# Altium schematic sheet RF-car.SchDoc
size A3; SPICEModelCacheRLVYLVLF: <root> / <DocumentId>RLVYLVLF</DocumentId> / <CacheFrame Number="0"> / <Model Name="qnpn" Kind="MDL"> / <Text>*QNPN / *NPN Trans Pinout: C,B,E / .MODEL QNPN NPN(IS=3.2E-16 BF=141 VAF=35 ISE=2.6 NE=1.46 CJE=1E-13 / + MJE=0.333 TF=6E-11 CJC=1E-13 CJS=2.2E-13 MJS=0.5 FC=0.67 )</Text> / </Model> / <Model Name="dtunnel1" Kind="CKT"> / <Text>*Tunnel Diode Default / *MCE 600V 50A 27.2ns default parameters / *Diode Pinout: A,K / * Parameters: / * RS:  Series resistance value / * RP:  Negative resistance value in parallel with capacitance. / * CP:   Capacitance value in parallel with negative resistance. / * LS:  Series inductance value. / * / * / .SUBCKT DTUNNEL1 1 2 PARAMS: Rs=6 Rp=-75 Cp=0.6E-12 Ls=0.1nH / RS  1 3  {Rs} / RP  3 4  {Rp} / CP  3 4  {Cp} / LS  4 2  {Ls} / .ENDS DTUNNEL1</Text> / </Model> / <Model Name="pnp" Kind="MDL"> / <Text>*Default PNP BJT / *PNP Trans Pinout: C,B,E / .MODEL PNP PNP()</Text> / </Model> / </CacheFrame> / </root>
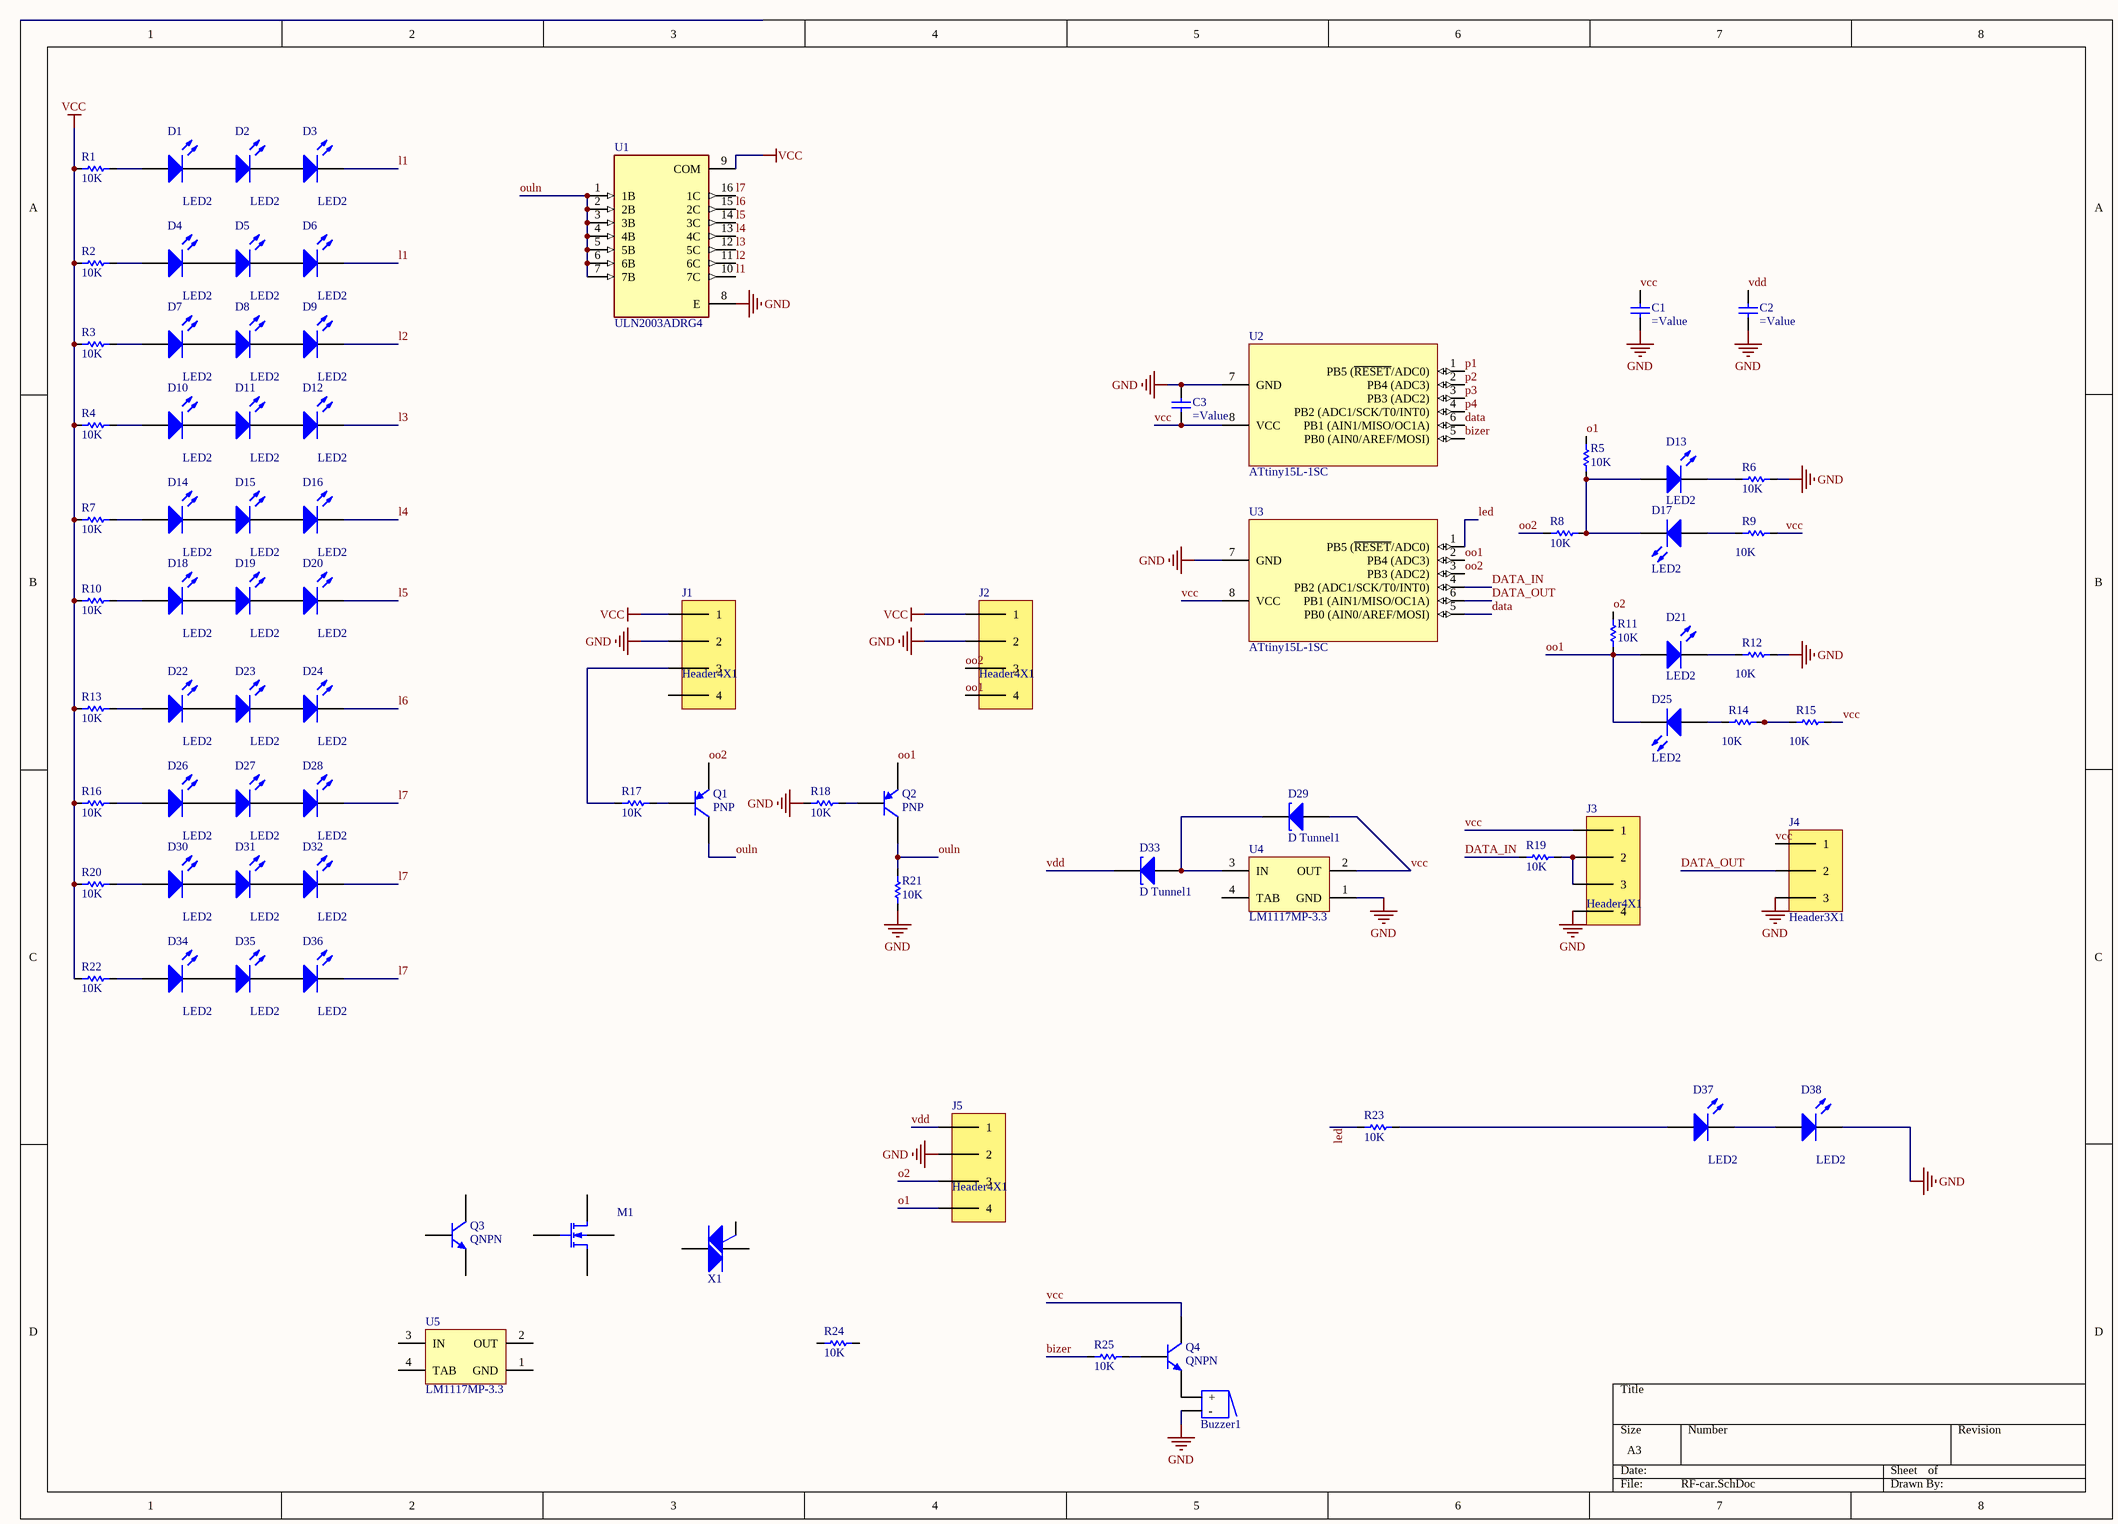
[diagram p0: RF-car.SchDoc]

## Parts
Buzzer1  Buzzer  [BUZZER]  (value not drawn)
C1  (no value)  [CAP 1206]
C2  (no value)  [CAP 1206]
C3  (no value)  [CAP 1206]
D1  LED2  [3.2X1.6X1.1]
D2  LED2  [3.2X1.6X1.1]
D3  LED2  [3.2X1.6X1.1]
D4  LED2  [3.2X1.6X1.1]
D5  LED2  [3.2X1.6X1.1]
D6  LED2  [3.2X1.6X1.1]
D7  LED2  [3.2X1.6X1.1]
D8  LED2  [3.2X1.6X1.1]
D9  LED2  [3.2X1.6X1.1]
D10  LED2  [3.2X1.6X1.1]
D11  LED2  [3.2X1.6X1.1]
D12  LED2  [3.2X1.6X1.1]
D13  LED2  [3.2X1.6X1.1]
D14  LED2  [3.2X1.6X1.1]
D15  LED2  [3.2X1.6X1.1]
D16  LED2  [3.2X1.6X1.1]
D17  LED2  [3.2X1.6X1.1]
D18  LED2  [3.2X1.6X1.1]
D19  LED2  [3.2X1.6X1.1]
D20  LED2  [3.2X1.6X1.1]
D21  LED2  [3.2X1.6X1.1]
D22  LED2  [3.2X1.6X1.1]
D23  LED2  [3.2X1.6X1.1]
D24  LED2  [3.2X1.6X1.1]
D25  LED2  [3.2X1.6X1.1]
D26  LED2  [3.2X1.6X1.1]
D27  LED2  [3.2X1.6X1.1]
D28  LED2  [3.2X1.6X1.1]
D29  D Tunnel1  [3.2X1.6X1.1]
D30  LED2  [3.2X1.6X1.1]
D31  LED2  [3.2X1.6X1.1]
D32  LED2  [3.2X1.6X1.1]
D33  D Tunnel1  [3.2X1.6X1.1]
D34  LED2  [3.2X1.6X1.1]
D35  LED2  [3.2X1.6X1.1]
D36  LED2  [3.2X1.6X1.1]
D37  LED2  [3.2X1.6X1.1]
D38  LED2  [3.2X1.6X1.1]
J1  Header4X1  [HEADER 4X1]
J2  Header4X1  [HEADER 4X1]
J3  Header4X1  [HEADER 4X1]
J4  Header3X1  [HEADER 3X1]
J5  Header4X1  [HEADER 4X1]
M1  N-channel MOSFET BSIM4v7 v4.7.0 Model  (value not drawn)
Q1  PNP  [SOT-23B_N]
Q2  PNP  [SOT-23B_N]
Q3  QNPN  [SOT-23B_L]
Q4  QNPN  [SOT-23B_L]
R1  10K  [RES 1206 (3216X08L)]
R2  10K  [RES 1206 (3216X08L)]
R3  10K  [RES 1206 (3216X08L)]
R4  10K  [RES 1206 (3216X08L)]
R5  10K  [RES 1206 (3216X08L)]
R6  10K  [RES 1206 (3216X08L)]
R7  10K  [RES 1206 (3216X08L)]
R8  10K  [RES 1206 (3216X08L)]
R9  10K  [RES 1206 (3216X08L)]
R10  10K  [RES 1206 (3216X08L)]
R11  10K  [RES 1206 (3216X08L)]
R12  10K  [RES 1206 (3216X08L)]
R13  10K  [RES 1206 (3216X08L)]
R14  10K  [RES 1206 (3216X08L)]
R15  10K  [RES 1206 (3216X08L)]
R16  10K  [RES 1206 (3216X08L)]
R17  10K  [RES 1206 (3216X08L)]
R18  10K  [RES 1206 (3216X08L)]
R19  10K  [RES 1206 (3216X08L)]
R20  10K  [RES 1206 (3216X08L)]
R21  10K  [RES 1206 (3216X08L)]
R22  10K  [RES 1206 (3216X08L)]
R23  10K  [RES 1206 (3216X08L)]
R24  10K  [RES 1206 (3216X08L)]
R25  10K  [RES 1206 (3216X08L)]
U1  ULN2003ADRG4  [SOIC127P600X175-16N]
U2  ATtiny15L-1SC  [8S2_N]
U3  ATtiny15L-1SC  [8S2_N]
U4  LM1117MP-3.3  [SOT89L]
U5  LM1117MP-3.3  [SOT89L]
X1  TRIAC Thyristror  (value not drawn)

## Nets
GND: Buzzer1.2(-) C1.1(+) C2.1(+) C3.2(-) D38.2(K) J1.2 J2.2 J3.4 J4.3 J5.2 R6.2 R12.2 R18.1 R21.1 U1.8(E) U2.7(GND) U3.7(GND) U4.1(GND)
vcc: C1.2(-) C3.1(+) D29.1(A) J1.1 J2.1 J3.1 J4.1 Q4.1(C) R1.1 R2.1 R3.1 R4.1 R7.1 R9.2 R10.1 R13.1 R15.2 R16.1 R20.1 R22.1 U1.9(COM) U2.8(VCC) U3.8(VCC) U4.2(OUT)
bizer: R25.1 U2.5(PB0_(AIN0/AREF/MOSI))
data: U2.6(PB1_(AIN1/MISO/OC1A)) U3.5(PB0_(AIN0/AREF/MOSI))
DATA_IN: R19.1 U3.4(PB2_(ADC1/SCK/T0/INT0))
DATA_OUT: J4.2 U3.6(PB1_(AIN1/MISO/OC1A))
l1: D3.2(K) D6.2(K) U1.10(7C)
l2: D9.2(K) U1.11(6C)
l3: D12.2(K) U1.12(5C)
l4: D16.2(K) U1.13(4C)
l5: D20.2(K) U1.14(3C)
l6: D24.2(K) U1.15(2C)
l7: D28.2(K) D32.2(K) D36.2(K) U1.16(1C)
led: R23.1 U3.1(PB5_(~{RESET}/ADC0))
o1: J5.4 R5.2
o2: J5.3 R11.2
oo1: D21.1(A) D25.2(K) J2.4 Q2.3(E) R11.1 U3.2(PB4_(ADC3))
oo2: J2.3 Q1.3(E) R8.2 U3.3(PB3_(ADC2))
ouln: Q1.1(C) Q2.1(C) R21.2 U1.1(1B) U1.2(2B) U1.3(3B) U1.4(4B) U1.5(5B) U1.6(6B) U1.7(7B)
p1: U2.1(PB5_(~{RESET}/ADC0))
p2: U2.2(PB4_(ADC3))
p3: U2.3(PB3_(ADC2))
p4: U2.4(PB2_(ADC1/SCK/T0/INT0))
vdd: C2.2(-) D33.2(K) J5.1
NetBuzzer1_1: Buzzer1.1(+) Q4.3(E)
NetD1_1: D1.1(A) R1.2
NetD1_2: D1.2(K) D2.1(A)
NetD2_2: D2.2(K) D3.1(A)
NetD4_1: D4.1(A) R2.2
NetD4_2: D4.2(K) D5.1(A)
NetD5_2: D5.2(K) D6.1(A)
NetD7_1: D7.1(A) R3.2
NetD7_2: D7.2(K) D8.1(A)
NetD8_2: D8.2(K) D9.1(A)
NetD10_1: D10.1(A) R4.2
NetD10_2: D10.2(K) D11.1(A)
NetD11_2: D11.2(K) D12.1(A)
NetD13_1: D13.1(A) D17.2(K) R5.1 R8.1
NetD13_2: D13.2(K) R6.1
NetD14_1: D14.1(A) R7.2
NetD14_2: D14.2(K) D15.1(A)
NetD15_2: D15.2(K) D16.1(A)
NetD17_1: D17.1(A) R9.1
NetD18_1: D18.1(A) R10.2
NetD18_2: D18.2(K) D19.1(A)
NetD19_2: D19.2(K) D20.1(A)
NetD21_2: D21.2(K) R12.1
NetD22_1: D22.1(A) R13.2
NetD22_2: D22.2(K) D23.1(A)
NetD23_2: D23.2(K) D24.1(A)
NetD25_1: D25.1(A) R14.1
NetD26_1: D26.1(A) R16.2
NetD26_2: D26.2(K) D27.1(A)
NetD27_2: D27.2(K) D28.1(A)
NetD29_2: D29.2(K) D33.1(A) U4.3(IN)
NetD30_1: D30.1(A) R20.2
NetD30_2: D30.2(K) D31.1(A)
NetD31_2: D31.2(K) D32.1(A)
NetD34_1: D34.1(A) R22.2
NetD34_2: D34.2(K) D35.1(A)
NetD35_2: D35.2(K) D36.1(A)
NetD37_1: D37.1(A) R23.2
NetD37_2: D37.2(K) D38.1(A)
NetJ1_3: J1.3 R17.1
NetJ3_2: J3.2 J3.3 R19.2
NetQ1_2: Q1.2(B) R17.2
NetQ2_2: Q2.2(B) R18.2
NetQ4_2: Q4.2(B) R25.2
NetR14_2: R14.2 R15.1

Not connected (* = marked no-connect by the designer): J1 4; M1 1(D) 2(G) 3(S) 4(B); Q3 1(C) 2(B) 3(E); R24 1 2; U4 4(TAB); U5 1(GND) 2(OUT) 3(IN) 4(TAB); X1 1(A) 2(K) 3

## Library data of the parts
Buzzer1 = Buzzer: Designer: Seyed Mohsen Ghasemain; ComponentLinkURL: www.picpars.com
C1-C3 = Capacitor
D1-D28 D30-D32 D34-D38 = LED2: Typical RED, GREEN, YELLOW, AMBER GaAs LED; Published: 8-Jun-2000; LatestRevisionDate: 17-Jul-2002; LatestRevisionNote: Re-released for DXP Platform.; PackageVersion: Feb-2002; PackageReference: 3.2X1.6X1.1; Publisher: Altium Limited; PackageDescription: SM LED; 2 Flat Leads
D29 D33 = D Tunnel1: Tunnel Diode - RLC Model; Published: 8-Jun-2000; LatestRevisionDate: 17-Jul-2002; LatestRevisionNote: Re-released for DXP Platform.; PackageVersion: Feb-2002; PackageReference: 3.2X1.6X1.1; Publisher: Altium Limited; PackageDescription: SM LED; 2 Flat Leads
M1 = MOSFET N-ch Lev14_3: A0: 1; A1: 0; AIGBACC: 0.0136; AIGBINV: 0.0111; AT: 33000; BG0SUB: 1.16; BGIDL: 2.3e09; BIGBACC: 0.00171; BIGBINV: 0.000949; BVD: 10; CAPMOD: 2; CDSC: 0.00024; CF: 1.07725e-10; CGDO: 1.03594e-09; CGIDL: 0.5; CIGBACC: 0.075; CIGBINV: 0.006; CJD: 0.0005; CJSWD: 5e-10; CKAPPAD: 0.6; CLC: 1e-07; DELTA: 0.01; DROUT: 0.56; DVT0: 2.2; DVT1: 0.53; DVT1W: 5.3e06; DVT2: -0.032; EASUB: 4.05; EGIDL: 0.8; EIGBINV: 1.1; EM: 4.1e07; EOT: 1.5e-09; EPSRGATE: 11.7; EPSROX: 3.9; ETA0: 0.08; ETAB: -0.07; EU: 1.67; GBMIN: 1e-12; IJTHDFWD: 0.1; JSD: 0.0001; K3: 80; KETA: -0.047; KT1: -0.11; KT2: 0.022; LC: 5e-09; LETAB: -0; LP: 1e-08; LPE0: 1.74e-07; MJSWD: 0.33; MOIN: 15; NDEP: 1.7e17; NI0SUB: 1.45e10; NIGBINV: 3; NJTS: 20; NOIA: 6.25e41; NOIB: 3.125e26; NOIC: 8.75e09; NSD: 1e20; NSUB: 6e16; PCLM: 1.3; PDIBLC1: 0.39; PDIBLC2: 0.0086; PSCBE1: 4.24e08; PSCBE2: 1e-05; RBDBX0: 100; RBPD0: 50; RDSW: 200; RNOIA: 0.577; RNOIB: 0.5164; RNOIC: 0.395; SAREF: 1e-06; TBGASUB: 0.000702; TBGBSUB: 1108; TEMPEOT: 300.15; TNOIA: 1.5; TNOIB: 3.5; TOXE: 3e-09; U0: 0.067; UA: 1e-09; UB: 1e-19; UB1: -1e-18; UC: -4.65e-11; UC1: -5.6e-11; UCSTE: -0.004775; UTE: -1.5; VBD_MAX: 1e99; VBM: -3; VFB: -1; VOFF: -0.08; VSAT: 80000; VTH0: 0.7; VTL: 200000; W0: 2.5e-06; XJ: 1.5e-07; XRCRG1: 12; XT: 1.55e-07; XTSD: 0.02; SimulationGenericComponent: True; A2: 1; ACDE: 1; ADOS: 1; AF: 1; AGIDL: 0; AGISL: 0; AGS: 0; AIGC: 0.0136; AIGD: 0.0136; AIGS: 0.0136; AIGSD: 0.0136; ALPHA0: 0; ALPHA1: 0; B0: 0; B1: 0; BDOS: 1; BETA0: 0; BGISL: 2.3e09; BIGC: 0.00171; BIGD: 0.00171; BIGS: 0.00171; BIGSD: 0.00171; BINUNIT: 1; BVS: 10; CDSCB: 0; CDSCD: 0; CGBO: 0; CGDL: 0; CGISL: 0.5; CGSL: 0; CGSO: 1.03594e-09; CIGC: 0.075; CIGD: 0.075; CIGS: 0.075; CIGSD: 0.075; CIT: 0; CJS: 0.0005; CJSWGD: 5e-10; CJSWGS: 5e-10; CJSWS: 5e-10; CKAPPAS: 0.6; CLE: 0.6; CVCHARGEMOD: 0; DIOMOD: 1; DLC: 0; DLCIG: 0; DLCIGD: 0; DMCG: 0; DMCGT: 0; DMCI: 0; DMDG: 0; DSUB: 0.56; DTOX: 0; DVT0W: 0; DVT2W: -0.032; DVTP0: 0; DVTP1: 0; DVTP2: 0; DVTP3: 0; DVTP4: 0; DVTP5: 0; DWB: 0; DWC: 0; DWG: 0; DWJ: 0; EF: 1; EGISL: 0.8; EPSRSUB: 11.7; FGIDL: 1; FGISL: 1; FNOIMOD: 1; FPROUT: 0; GAMMA1: 0; GAMMA2: 0; GIDLMOD: 0; IGBMOD: 0; IGCMOD: 0; IJTHDREV: 0.1; IJTHSFWD: 0.1; IJTHSREV: 0.1; JSS: 0.0001; JSWD: 0; JSWGD: 0; JSWGS: 0; JSWS: 0; JTSD: 0; JTSS: 0; JTSSWD: 0; JTSSWGD: 0; JTSSWGS: 0; JTSSWS: 0; JTWEFF: 0; K1: 0; K2: 0; K2WE: 0; K3B: 0; KF: 0; KGIDL: 0; KGISL: 0; KT1L: 0; KU0: 0; KU0WE: 0; KVSAT: 0; KVTH0: 0; KVTH0WE: 0; LA0: 0; LA1: 0; LA2: 0; LACDE: 0; LAGIDL: 0; LAGISL: 0; LAGS: 0; LAIGBACC: 0; LAIGBINV: 0; LAIGC: 0; LAIGD: 0; LAIGS: 0; LAIGSD: 0; LALPHA0: 0; LALPHA1: 0; LAMBDA: 0; LAT: 0; LB0: 0; LB1: 0; LBETA0: 0; LBGIDL: 0; LBGISL: 0; LBIGBACC: 0; LBIGBINV: 0; LBIGC: 0; LBIGD: 0; LBIGS: 0; LBIGSD: 0; LCDSC: 0; LCDSCB: 0; LCDSCD: 0; LCF: 0; LCGDL: 0; LCGIDL: 0; LCGISL: 0; LCGSL: 0; LCIGBACC: 0; LCIGBINV: 0; LCIGC: 0; LCIGD: 0; LCIGS: 0; LCIGSD: 0; LCIT: 0; LCKAPPAD: 0; LCKAPPAS: 0; LCLC: 0; LCLE: 0; LDELTA: 0; LDROUT: 0; LDSUB: 0; LDVT0: 0; LDVT0W: 0; LDVT1: 0; LDVT1W: 0; LDVT2: 0; LDVT2W: 0; LDVTP0: 0; LDVTP1: 0; LDVTP2: 0; LDVTP3: 0; LDVTP4: 0; LDVTP5: 0; LDWB: 0; LDWG: 0; LEFFEOT: 1; LEGIDL: 0; LEGISL: 0; LEIGBINV: 0; LETA0: 0; LEU: 0; LFGIDL: 0; LFGISL: 0; LFPROUT: 0; LGAMMA1: 0; LGAMMA2: 0; LINT: 0; LINTNOI: 0; LK1: 0; LK2: 0; LK2WE: 0; LK3: 0; LK3B: 0; LKETA: 0; LKGIDL: 0; LKGISL: 0; LKT1: 0; LKT1L: 0; LKT2: 0; LKU0: 0; LKU0WE: 0; LKVTH0: 0; LKVTH0WE: 0; LL: 0; LLAMBDA: 0; LLC: 0; LLN: 1; LLODKU0: 0; LLODVTH: 0; LLP: 0; LLPE0: 0; LLPEB: 0; LMAX: 1; LMIN: 0; LMINV: 0; LMINVCV: 0; LMOIN: 0; LNDEP: 0; LNFACTOR: 0; LNGATE: 0; LNIGBACC: 0; LNIGBINV: 0; LNIGC: 0; LNOFF: 0; LNSD: 0; LNSUB: 0; LNTOX: 0; LODETA0: 1; LODK2: 1; LPCLM: 0; LPDIBLC1: 0; LPDIBLC2: 0; LPDIBLCB: 0; LPDITS: 0; LPDITSD: 0; LPEB: 0; LPHIN: 0; LPIGCD: 0; LPOXEDGE: 0; LPRT: 0; LPRWB: 0; LPRWG: 0; LPSCBE1: 0; LPSCBE2: 0; LPVAG: 0; LRDSW: 0; LRDW: 0; LRGIDL: 0; LRGISL: 0; LRSW: 0; LTETA0: 0; LTNFACTOR: 0; LTVFBSDOFF: 0; LTVOFF: 0; LTVOFFCV: 0; LU0: 0; LUA: 0; LUA1: 0; LUB: 0; LUB1: 0; LUC: 0; LUC1: 0; LUCS: 0; LUCSTE: 0; LUD: 0; LUD1: 0; LUP: 0; LUTE: 0; LVBM: 0; LVBX: 0; LVFB: 0; LVFBCV: 0; LVFBSDOFF: 0; LVOFF: 0; LVOFFCV: 0; LVSAT: 0; LVTH0: 0; LVTL: 0; LW: 0; LW0: 0; LWC: 0; LWL: 0; LWLC: 0; LWN: 1; LWR: 0; LXJ: 0; LXN: 0; LXRCRG1: 0; LXRCRG2: 0; LXT: 0; MINV: 0; MINVCV: 0; MJD: 0.5; MJS: 0.5; MJSWGD: 0.33; MJSWGS: 0.33; MJSWS: 0.33; MOBMOD: 0; MTRLCOMPATMOD: 0; MTRLMOD: 0; NFACTOR: 1; NGATE: 0; NIGBACC: 1; NIGC: 1; NJD: 1; NJS: 1; NJTSD: 20; NJTSSW: 20; NJTSSWD: 20; NJTSSWG: 20; NJTSSWGD: 20; NOFF: 1; NTNOI: 1; NTOX: 1; PA0: 0; PA1: 0; PA2: 0; PACDE: 0; PAGIDL: 0; PAGISL: 0; PAGS: 0; PAIGBACC: 0; PAIGBINV: 0; PAIGC: 0; PAIGD: 0; PAIGS: 0; PAIGSD: 0; PALPHA0: 0; PALPHA1: 0; PARAMCHK: 1; PAT: 0; PB0: 0; PB1: 0; PBD: 1; PBETA0: 0; PBGIDL: 0; PBGISL: 0; PBIGBACC: 0; PBIGBINV: 0; PBIGC: 0; PBIGD: 0; PBIGS: 0; PBIGSD: 0; PBS: 1; PBSWD: 1; PBSWGD: 1; PBSWGS: 1; PBSWS: 1; PCDSC: 0; PCDSCB: 0; PCDSCD: 0; PCF: 0; PCGDL: 0; PCGIDL: 0; PCGISL: 0; PCGSL: 0; PCIGBACC: 0; PCIGBINV: 0; PCIGC: 0; PCIGD: 0; PCIGS: 0; PCIGSD: 0; PCIT: 0; PCKAPPAD: 0; PCKAPPAS: 0; PCLC: 0; PCLE: 0; PDELTA: 0; PDIBLCB: 0; PDITS: 0; PDITSD: 0; PDITSL: 0; PDROUT: 0; PDSUB: 0; PDVT0: 0; PDVT0W: 0; PDVT1: 0; PDVT1W: 0; PDVT2: 0; PDVT2W: 0; PDVTP0: 0; PDVTP1: 0; PDVTP2: 0; PDVTP3: 0; PDVTP4: 0; PDVTP5: 0; PDWB: 0; PDWG: 0; PEGIDL: 0; PEGISL: 0; PEIGBINV: 0; PERMOD: 1; PETA0: 0; PETAB: 0; PEU: 0; PFGIDL: 0; PFGISL: 0; PFPROUT: 0; PGAMMA1: 0; PGAMMA2: 0; PHIG: 4.05; PHIN: 0; PIGCD: 1; PK1: 0; PK2: 0; PK2WE: 0; PK3: 0; PK3B: 0; PKETA: 0; PKGIDL: 0; PKGISL: 0; PKT1: 0; PKT1L: 0; PKT2: 0; PKU0: 0; PKU0WE: 0; PKVTH0: 0; PKVTH0WE: 0; PLAMBDA: 0; PLP: 0; PLPE0: 0; PLPEB: 0; PMINV: 0; PMINVCV: 0; PMOIN: 0; PNDEP: 0; PNFACTOR: 0; PNGATE: 0; PNIGBACC: 0; PNIGBINV: 0; PNIGC: 0; PNOFF: 0; PNSD: 0; PNSUB: 0; PNTOX: 0; POXEDGE: 1; PPCLM: 0; PPDIBLC1: 0; PPDIBLC2: 0; PPDIBLCB: 0; PPDITS: 0; PPDITSD: 0; PPHIN: 0; PPIGCD: 0; PPOXEDGE: 0; PPRT: 0; PPRWB: 0; PPRWG: 0; PPSCBE1: 0; PPSCBE2: 0; PPVAG: 0; PRDSW: 0; PRDW: 0; PRGIDL: 0; PRGISL: 0; PRSW: 0; PRT: 0; PRWB: 0; PRWG: 1; PTETA0: 0; PTNFACTOR: 0; PTVFBSDOFF: 0; PTVOFF: 0; PTVOFFCV: 0; PU0: 0; PUA: 0; PUA1: 0; PUB: 0; PUB1: 0; PUC: 0; PUC1: 0; PUCS: 0; PUCSTE: 0; PUD: 0; PUD1: 0; PUP: 0; PUTE: 0; PVAG: 0; PVBM: 0; PVBX: 0; PVFB: 0; PVFBCV: 0; PVFBSDOFF: 0; PVOFF: 0; PVOFFCV: 0; PVSAT: 0; PVTH0: 0; PVTL: 0; PW0: 0; PWR: 0; PXJ: 0; PXN: 0; PXRCRG1: 0; PXRCRG2: 0; PXT: 0; RBDBY0: 100; RBPBX0: 100; RBPBXL: 0; RBPBXNF: 0; RBPBXW: 0; RBPBY0: 100; RBPBYL: 0; RBPBYNF: 0; RBPBYW: 0; RBPDL: 0; RBPDNF: 0; RBPDW: 0; RBPS0: 50; RBPSL: 0; RBPSNF: 0; RBPSW: 0; RBSBX0: 100; RBSBY0: 100; RBSDBXL: 0; RBSDBXNF: 0; RBSDBXW: 0; RBSDBYL: 0; RBSDBYNF: 0; RBSDBYW: 0; RDSMOD: 0; RDSWMIN: 0; RDW: 100; RDWMIN: 0; RGIDL: 1; RGISL: 1; RSH: 0; RSHG: 0.1; RSW: 100; RSWMIN: 0; SBREF: 1e-06; SCREF: 1e-06; STETA0: 0; STK2: 0; TCJ: 0; TCJSW: 0; TCJSWG: 0; TEMPMOD: 0; TETA0: 0; TKU0: 0; TNFACTOR: 0; TNJTS: 0; TNJTSD: 0; TNJTSSW: 0; TNJTSSWD: 0; TNJTSSWG: 0; TNJTSSWGD: 0; TNOIC: 0; TNOIMOD: 0; TNOM: 300.15; TOXM: 3e-09; TOXP: 3e-09; TOXREF: 3e-09; TPB: 0; TPBSW: 0; TPBSWG: 0; TVFBSDOFF: 0; TVOFF: 0; TVOFFCV: 0; UA1: 1e-09; UCS: 1.67; UD: 0; UD1: 0; UP: 0; VBDR_MAX: 1e99; VBS_MAX: 1e99; VBSR_MAX: 1e99; VBX: 0; VDDEOT: 1.5; VDS_MAX: 1e99; VERSION: 4.8.1; VFBCV: -1; VFBSDOFF: 0; VGB_MAX: 1e99; VGBR_MAX: 1e99; VGD_MAX: 1e99; VGDR_MAX: 1e99; VGS_MAX: 1e99; VGSR_MAX: 1e99; VOFFCV: 0; VOFFCVL: 0; VOFFL: 0; VTSD: 10; VTSS: 10; VTSSWD: 10; VTSSWGD: 10; VTSSWGS: 10; VTSSWS: 10; WA0: 0; WA1: 0; WA2: 0; WACDE: 0; WAGIDL: 0; WAGISL: 0; WAGS: 0; WAIGBACC: 0; WAIGBINV: 0; WAIGC: 0; WAIGD: 0; WAIGS: 0; WAIGSD: 0; WALPHA0: 0; WALPHA1: 0; WAT: 0; WB0: 0; WB1: 0; WBETA0: 0; WBGIDL: 0; WBGISL: 0; WBIGBACC: 0; WBIGBINV: 0; WBIGC: 0; WBIGD: 0; WBIGS: 0; WBIGSD: 0; WCDSC: 0; WCDSCB: 0; WCDSCD: 0; WCF: 0; WCGDL: 0; WCGIDL: 0; WCGISL: 0; WCGSL: 0; WCIGBACC: 0; WCIGBINV: 0; WCIGC: 0; WCIGD: 0; WCIGS: 0; WCIGSD: 0; WCIT: 0; WCKAPPAD: 0; WCKAPPAS: 0; WCLC: 0; WCLE: 0; WDELTA: 0; WDROUT: 0; WDSUB: 0; WDVT0: 0; WDVT0W: 0; WDVT1: 0; WDVT1W: 0; WDVT2: 0; WDVT2W: 0; WDVTP0: 0; WDVTP1: 0; WDVTP2: 0; WDVTP3: 0; WDVTP4: 0; WDVTP5: 0; WDWB: 0; WDWG: 0; WEB: 0; WEC: 0; WEFFEOT: 10; WEGIDL: 0; WEGISL: 0; WEIGBINV: 0; WETA0: 0; WETAB: 0; WEU: 0; WFGIDL: 0; WFGISL: 0; WFPROUT: 0; WGAMMA1: 0; WGAMMA2: 0; WINT: 0; WK1: 0; WK2: 0; WK2WE: 0; WK3: 0; WK3B: 0; WKETA: 0; WKGIDL: 0; WKGISL: 0; WKT1: 0; WKT1L: 0; WKT2: 0; WKU0: 0; WKU0WE: 0; WKVTH0: 0; WKVTH0WE: 0; WL: 0; WLAMBDA: 0; WLC: 0; WLN: 1; WLOD: 0; WLODKU0: 0; WLODVTH: 0; WLP: 0; WLPE0: 0; WLPEB: 0; WMAX: 1; WMIN: 0; WMINV: 0; WMINVCV: 0; WMOIN: 0; WNDEP: 0; WNFACTOR: 0; WNGATE: 0; WNIGBACC: 0; WNIGBINV: 0; WNIGC: 0; WNOFF: 0; WNSD: 0; WNSUB: 0; WNTOX: 0; WPCLM: 0; WPDIBLC1: 0; WPDIBLC2: 0; WPDIBLCB: 0; WPDITS: 0; WPDITSD: 0; WPEMOD: 0; WPHIN: 0; WPIGCD: 0; WPOXEDGE: 0; WPRT: 0; WPRWB: 0; WPRWG: 0; WPSCBE1: 0; WPSCBE2: 0; WPVAG: 0; WR: 1; WRDSW: 0; WRDW: 0; WRGIDL: 0; WRGISL: 0; WRSW: 0; WTETA0: 0; WTNFACTOR: 0; WTVFBSDOFF: 0; WTVOFF: 0; WTVOFFCV: 0; WU0: 0; WUA: 0; WUA1: 0; WUB: 0; WUB1: 0; WUC: 0; WUC1: 0; WUCS: 0; WUCSTE: 0; WUD: 0; WUD1: 0; WUP: 0; WUTE: 0; WVBM: 0; WVBX: 0; WVFB: 0; WVFBCV: 0; WVFBSDOFF: 0; WVOFF: 0; WVOFFCV: 0; WVSAT: 0; WVTH0: 0; WVTL: 0; WW: 0; WW0: 0; WWC: 0; WWL: 0; WWLC: 0; WWN: 1; WWR: 0; WXJ: 0; WXN: 0; WXRCRG1: 0; WXRCRG2: 0; WXT: 0; XGL: 0; XJBVD: 1; XJBVS: 1; XL: 0; XN: 3; XPART: 0; XRCRG2: 1; XTID: 3; XTIS: 3; XTSS: 0.02; XTSSWD: 0.02; XTSSWGD: 0.02; XTSSWGS: 0.02; XTSSWS: 0.02; XW: 0
Q1 Q2 = PNP: PNP Bipolar Transistor; pin to pad: 1>3 2>1 3>2; Published: 8-Jun-2000; LatestRevisionDate: 29-May-2009; LatestRevisionNote: IPC-7351 Footprint Added.; PackageVersion: Aug-1999; PackageReference: SOT-23B; Publisher: Altium Limited; PackageDescription: 3-Pin SOT-23 Package 0.95 mm Pitch, 2.4 mm Lead Span
Q3 Q4 = QNPN: NPN Bipolar Transistor; pin to pad: 1>3 2>1 3>2; Published: 8-Jun-2000; LatestRevisionDate: 29-May-2009; LatestRevisionNote: IPC-7351 Footprint Added.; PackageVersion: Aug-1999; PackageReference: SOT-23B; Publisher: Altium Limited; PackageDescription: 3-Pin SOT-23 Package 0.95 mm Pitch, 2.4 mm Lead Span
R1-R25 = Resistor: Tolerance: 5%; Power: 1/4 W; Value: 10K
U1 = ULN2003ADRG4: 50-V, 7-ch darlington transistor array, -20C to 70C 16-SOIC -40 to 70; Price: None; MP: ULN2003ADRG4; Availability: Unavailable; Package: None; Value: *
U2 = ATtiny15L-1SC: 8-Bit AVR Microcontroller with 1K Byte of Flash Memory; Published: 17-Sep-2003; LatestRevisionDate: 16-Oct-2006; LatestRevisionNote: IPC-7351 Footprint Added.; DatasheetVersion: 1187E-AVR-06/02; PackageVersion: revF, Apr-2008; PackageReference: 8S2; Publisher: Altium Limited; PackageDescription: 8-Lead, 0.208" Body, Plastic Small Outline Package (EIAJ); Supplier 1: Digi-Key; Supplier Part Number 1: ATTINY15L-1SC-ND; Supplier 2: Mouser; Supplier Part Number 2: 556-ATTINY15L1SC; ComponentLink1Description: Datasheet; ComponentLink1URL: http://www.atmel.com/dyn/resources/prod_documents/doc1187.pdf; ComponentLink2Description: Atmel.com Home; ComponentLink2URL: http://www.atmel.com
U3 = ATtiny15L-1SC: 8-Bit AVR Microcontroller with 1K Byte of Flash Memory; pin to pad: 1>7 7>8 8>1; Published: 17-Sep-2003; LatestRevisionDate: 16-Oct-2006; LatestRevisionNote: IPC-7351 Footprint Added.; DatasheetVersion: 1187E-AVR-06/02; PackageVersion: revF, Apr-2008; PackageReference: 8S2; Publisher: Altium Limited; PackageDescription: 8-Lead, 0.208" Body, Plastic Small Outline Package (EIAJ); Supplier 1: Digi-Key; Supplier Part Number 1: ATTINY15L-1SC-ND; Supplier 2: Mouser; Supplier Part Number 2: 556-ATTINY15L1SC; ComponentLink1Description: Datasheet; ComponentLink1URL: http://www.atmel.com/dyn/resources/prod_documents/doc1187.pdf; ComponentLink2Description: Atmel.com Home; ComponentLink2URL: http://www.atmel.com
U4 U5 = LM1117MP-3.3: 800mA Low-Dropout Linear Regulator; pin to pad: 1>2 2>1; Manufacturer: National Semiconductor; CompType: LDO IC; PackageTopMarking: XYTT*N05A; PowerWise: N; Published: 4-Dec-2008; DatasheetVersion: Apr-2006; PackageVersion: revB, Apr-2003; PackageReference: MP04A; Publisher: Altium Limited; PackageDescription: Molded SOT-223, 6.50 x 3.56 x 1.6mm Body, 4 Lead, 2.3mm Pitch; PartNumber: LM1117MP-3.3; RoHS: O; PinCount: 4; DigiKeyPartNumber: LM1117MP-3.3CT-ND; Code_JEDEC: TO-261-AA; Code_IPC: SOT223-4; ComponentLink1Description: LM1117 Datasheet; ComponentLink1URL: http://www.national.com/ds/LM/LM1117.pdf; ComponentLink2Description: LM1117 Web Page; ComponentLink2URL: http://www.national.com/pf/LM/LM1117.html; ComponentLink3Description: MP04A Package Page; ComponentLink3URL: http://www.national.com/packaging/folders/mp04a.html
X1 = TRIAC: IH: 50MA; IGT: 40MA; TON: 1US; VTMIN: 1V; VDRM: 50V; DVDT: 50MEG; TQ: 20US; K1: 1; SimulationGenericComponent: True; K2: 1